# Altium schematic sheet Industrial-Controller_MCU1.SchDoc: MCU
size 558 x 431 mm; Date: not used; ApprovedBy: not used; CheckedBy: not used; Author: not used; DrawnBy: not used; Organization: not used; Address4: not used; SheetNumber: 6; SheetTotal: 21; Time: not used; ImagePath: not used; Application_BuildNumber: not used
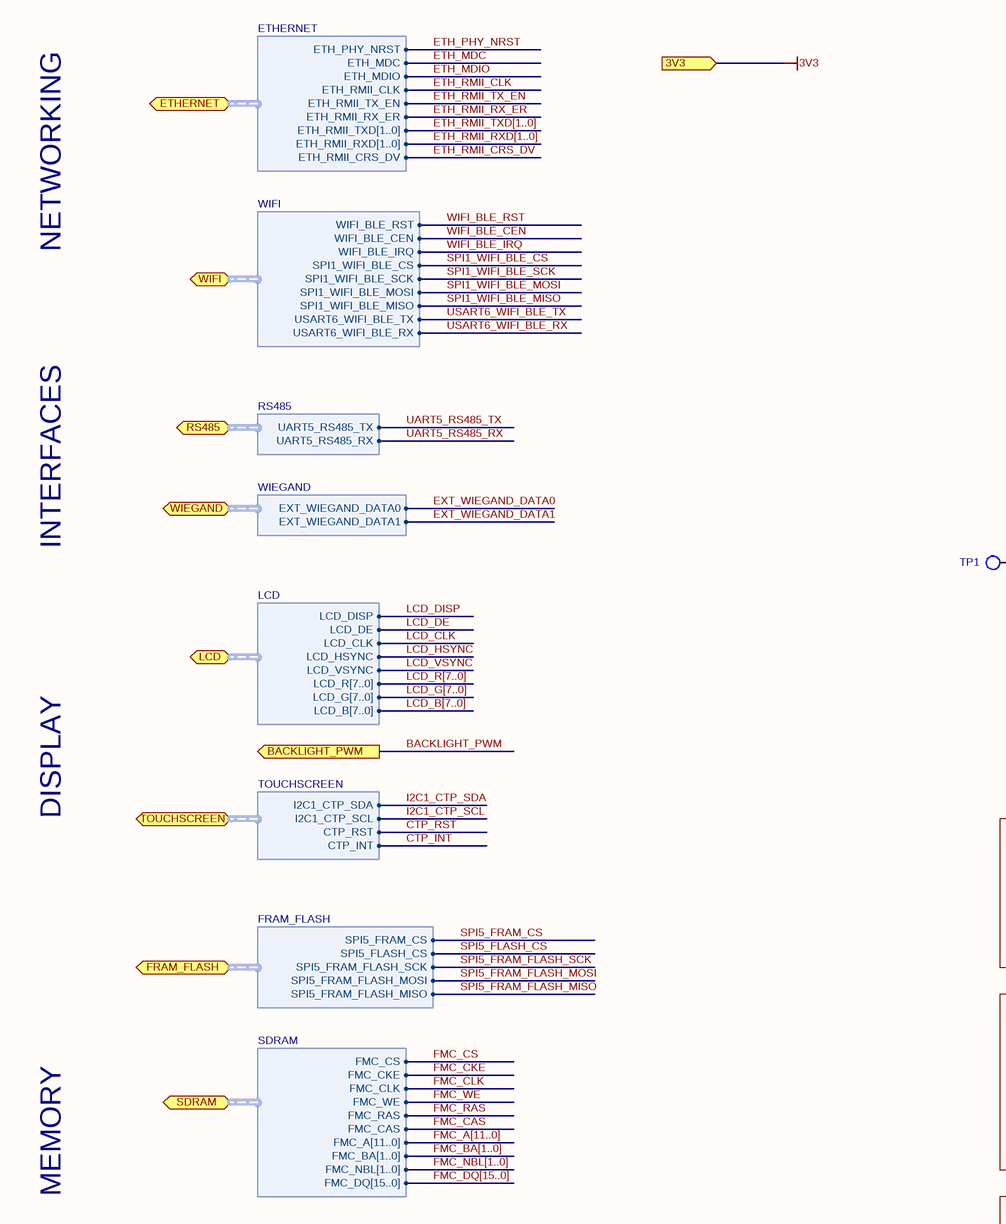
[diagram p0: Industrial-Controller_MCU1.SchDoc, top left]
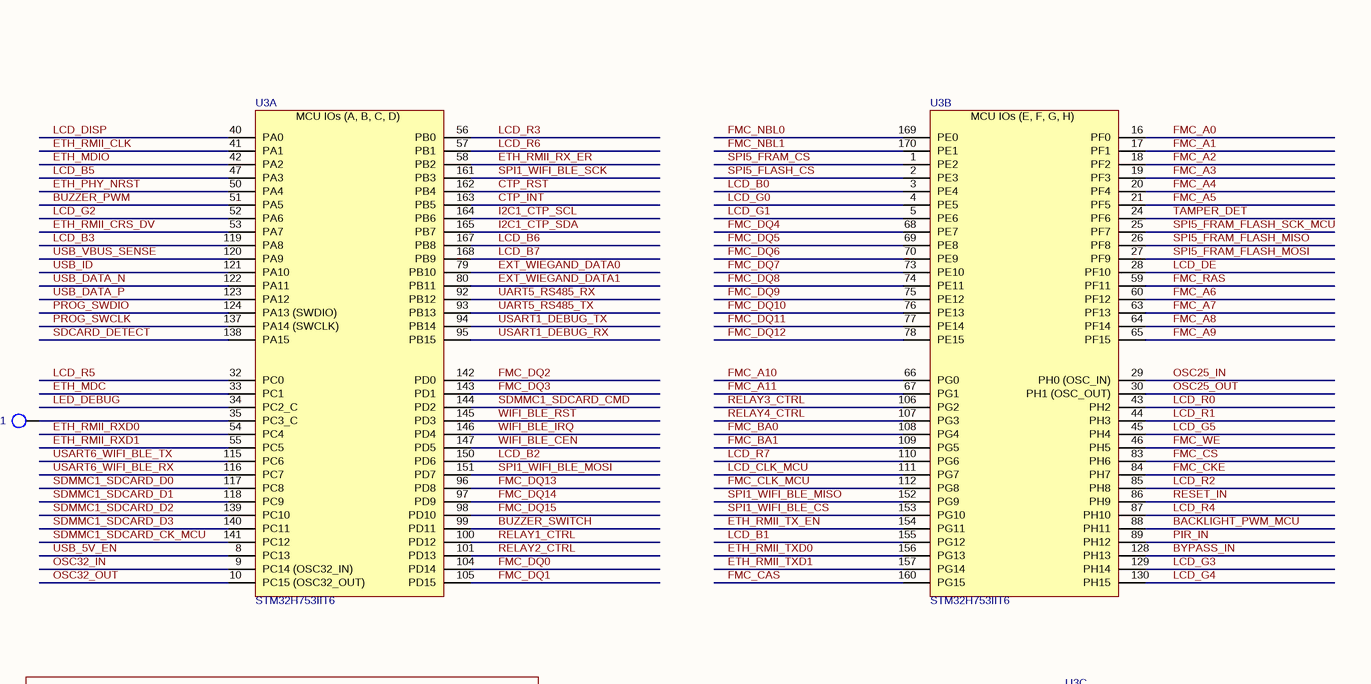
[diagram p1: Industrial-Controller_MCU1.SchDoc, top right]
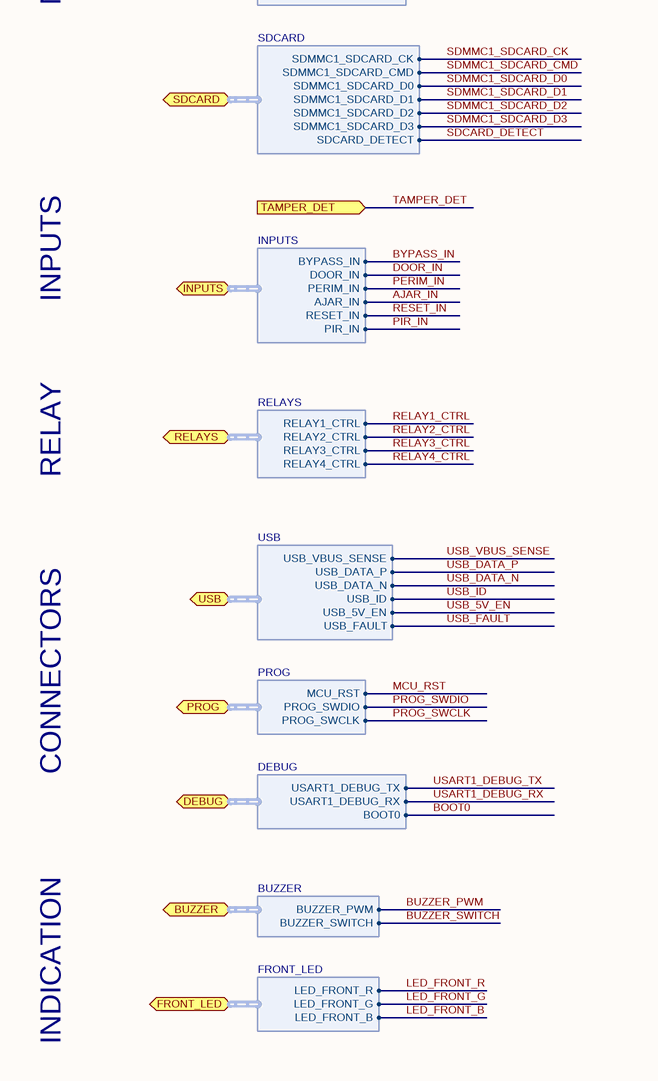
[diagram p2: Industrial-Controller_MCU1.SchDoc, bottom left]
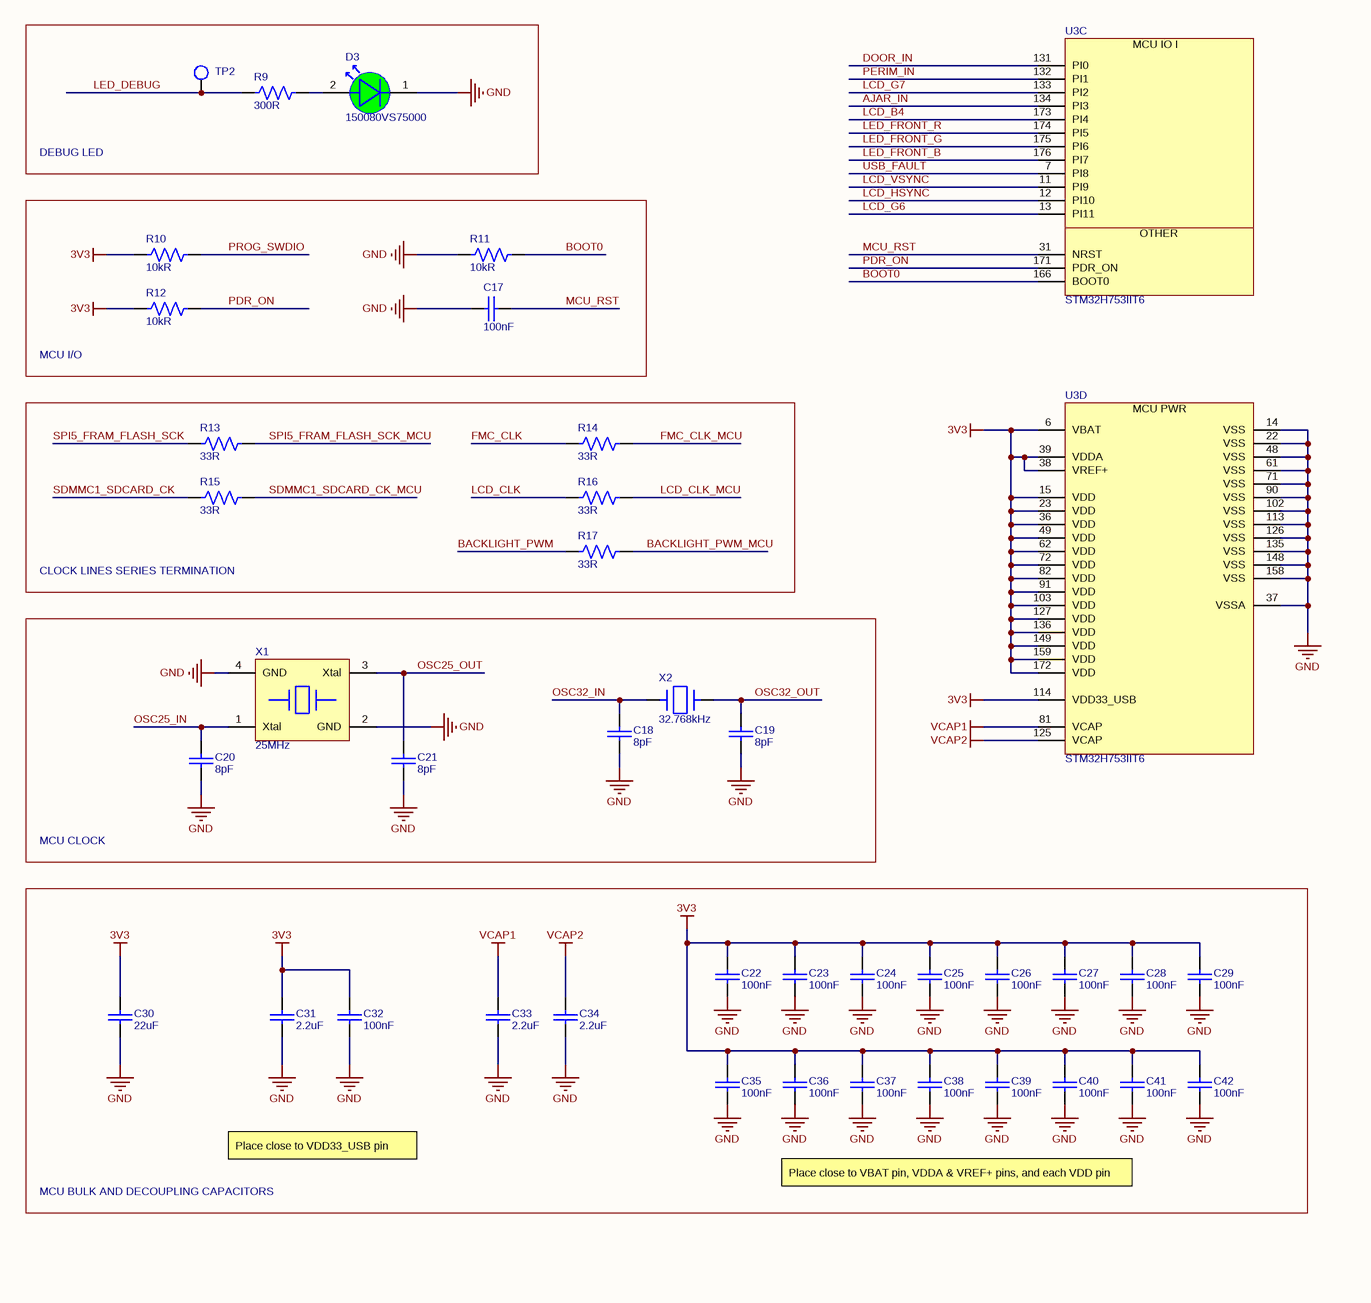
[diagram p3: Industrial-Controller_MCU1.SchDoc, bottom right]

## Parts
C17  100nF  [CAP_0603]
C18  8pF  [CAP_0603]
C19  8pF  [CAP_0603]
C20  8pF  [CAP_0603]
C21  8pF  [CAP_0603]
C22  100nF  [CAP_0603]
C23  100nF  [CAP_0603]
C24  100nF  [CAP_0603]
C25  100nF  [CAP_0603]
C26  100nF  [CAP_0603]
C27  100nF  [CAP_0603]
C28  100nF  [CAP_0603]
C29  100nF  [CAP_0603]
C30  22uF  [CAP_1210]
C31  2.2uF  [CAP_0603]
C32  100nF  [CAP_0603]
C33  2.2uF  [CAP_0603]
C34  2.2uF  [CAP_0603]
C35  100nF  [CAP_0603]
C36  100nF  [CAP_0603]
C37  100nF  [CAP_0603]
C38  100nF  [CAP_0603]
C39  100nF  [CAP_0603]
C40  100nF  [CAP_0603]
C41  100nF  [CAP_0603]
C42  100nF  [CAP_0603]
D3  150080VS75000  [LED_0805]
R9  300R  [RES_0603]
R10  10kR  [RES_0603]
R11  10kR  [RES_0603]
R12  10kR  [RES_0603]
R13  33R  [RES_0603]
R14  33R  [RES_0603]
R15  33R  [RES_0603]
R16  33R  [RES_0603]
R17  33R  [RES_0603]
TP1  TEST_POINT_SMT  [TEST_POINT_SMT]  (value not drawn)  (no BOM)
TP2  TEST_POINT_SMT  [TEST_POINT_SMT]  (value not drawn)  (no BOM)
U3  STM32H753IIT6  [LQFP176]  (parts A,B,C,D of 4)
X1  25MHz  [NX2016SA-25MHZ-EXS00A-CS11365]
X2  32.768kHz  [NX2012SA-32.768KHZ-EXS00A-MU00626]

## Blocks framed on the sheet
DEBUG LED: D3 R9 TP2
MCU I/O: C17 R10-R12
CLOCK LINES SERIES TERMINATION: R13-R17
MCU CLOCK: C18-C21 X1 X2
MCU BULK AND DECOUPLING CAPACITORS: C22-C42

## Ports
3V3 (in), BACKLIGHT_PWM (out), BUZZER (bidir, harness BUZZER), DEBUG (bidir, harness DEBUG), ETHERNET (bidir, harness ETHERNET), FRAM_FLASH (bidir, harness FRAM_FLASH), FRONT_LED (bidir, harness FRONT_LED), INPUTS (bidir, harness INPUTS), LCD (bidir, harness LCD), PROG (bidir, harness PROG), RELAYS (bidir, harness RELAYS), RS485 (bidir, harness RS485), SDCARD (bidir, harness SDCARD), SDRAM (bidir, harness SDRAM), TAMPER_DET (in), TOUCHSCREEN (bidir, harness TOUCHSCREEN), USB (bidir, harness USB), WIEGAND (bidir, harness WIEGAND), WIFI (bidir, harness WIFI)

## Harnesses
LCD: LCD_B[7..0], LCD_CLK, LCD_DE, LCD_DISP, LCD_G[7..0], LCD_HSYNC, LCD_R[7..0], LCD_VSYNC
ETHERNET: ETH_MDC, ETH_MDIO, ETH_PHY_NRST, ETH_RMII_CLK, ETH_RMII_CRS_DV, ETH_RMII_RXD[1..0], ETH_RMII_RX_ER, ETH_RMII_TXD[1..0], ETH_RMII_TX_EN
SDRAM: FMC_A[11..0], FMC_BA[1..0], FMC_CAS, FMC_CKE, FMC_CLK, FMC_CS, FMC_DQ[15..0], FMC_NBL[1..0], FMC_RAS, FMC_WE
INPUTS: AJAR_IN, BYPASS_IN, DOOR_IN, PERIM_IN, PIR_IN, RESET_IN
TOUCHSCREEN: CTP_INT, CTP_RST, I2C1_CTP_SCL, I2C1_CTP_SDA
BUZZER: BUZZER_SWITCH, BUZZER_PWM
RELAYS: RELAY1_CTRL, RELAY2_CTRL, RELAY3_CTRL, RELAY4_CTRL
FRONT_LED: LED_FRONT_B, LED_FRONT_G, LED_FRONT_R
WIEGAND: EXT_WIEGAND_DATA0, EXT_WIEGAND_DATA1
FRAM_FLASH: SPI5_FLASH_CS, SPI5_FRAM_CS, SPI5_FRAM_FLASH_MISO, SPI5_FRAM_FLASH_MOSI, SPI5_FRAM_FLASH_SCK
SDCARD: SDMMC1_SDCARD_CK, SDMMC1_SDCARD_CMD, SDMMC1_SDCARD_D0, SDMMC1_SDCARD_D1, SDMMC1_SDCARD_D2, SDMMC1_SDCARD_D3, SDCARD_DETECT
USB: USB_VBUS_SENSE, USB_DATA_P, USB_DATA_N, USB_ID, USB_5V_EN, USB_FAULT
DEBUG: USART1_DEBUG_TX, USART1_DEBUG_RX, BOOT0
PROG: MCU_RST, PROG_SWDIO, PROG_SWCLK
RS485: UART5_RS485_TX, UART5_RS485_RX
WIFI: WIFI_BLE_RST, WIFI_BLE_CEN, WIFI_BLE_IRQ, SPI1_WIFI_BLE_CS, SPI1_WIFI_BLE_SCK, SPI1_WIFI_BLE_MOSI, SPI1_WIFI_BLE_MISO, USART6_WIFI_BLE_TX, USART6_WIFI_BLE_RX

## Nets
3V3: C22.2 C23.2 C24.2 C25.2 C26.2 C27.2 C28.2 C29.2 C30.2 C31.2 C32.2 C35.2 C36.2 C37.2 C38.2 C39.2 C40.2 C41.2 C42.2 R10.1 R12.1 U3.6(VBAT) U3.15(VDD) U3.23(VDD) U3.36(VDD) U3.38(VREF+) U3.39(VDDA) U3.49(VDD) U3.62(VDD) U3.72(VDD) U3.82(VDD) U3.91(VDD) U3.103(VDD) U3.114(VDD33_USB) U3.127(VDD) U3.136(VDD) U3.149(VDD) U3.159(VDD) U3.172(VDD) ; port 3V3
GND: C17.1 C18.1 C19.1 C20.1 C21.1 C22.1 C23.1 C24.1 C25.1 C26.1 C27.1 C28.1 C29.1 C30.1 C31.1 C32.1 C33.1 C34.1 C35.1 C36.1 C37.1 C38.1 C39.1 C40.1 C41.1 C42.1 D3.1(C) R11.1 U3.14(VSS) U3.22(VSS) U3.37(VSSA) U3.48(VSS) U3.61(VSS) U3.71(VSS) U3.90(VSS) U3.102(VSS) U3.113(VSS) U3.126(VSS) U3.135(VSS) U3.148(VSS) U3.158(VSS) X1.2(GND) X1.4(GND)
VCAP1: C33.2 U3.81(VCAP)
VCAP2: C34.2 U3.125(VCAP)
AJAR_IN: U3.134(PI3) ; port INPUTS.AJAR_IN
BACKLIGHT_PWM: R17.1 ; port BACKLIGHT_PWM
BACKLIGHT_PWM_MCU: R17.2 U3.88(PH11)
BOOT0: R11.2 U3.166(BOOT0) ; port DEBUG.BOOT0
BUZZER_PWM: U3.51(PA5) ; port BUZZER.BUZZER_PWM
BUZZER_SWITCH: U3.99(PD11) ; port BUZZER.BUZZER_SWITCH
BYPASS_IN: U3.128(PH13) ; port INPUTS.BYPASS_IN
CTP_INT: U3.163(PB5) ; port TOUCHSCREEN.CTP_INT
CTP_RST: U3.162(PB4) ; port TOUCHSCREEN.CTP_RST
DOOR_IN: U3.131(PI0) ; port INPUTS.DOOR_IN
ETH_MDC: U3.33(PC1) ; port ETHERNET.ETH_MDC
ETH_MDIO: U3.42(PA2) ; port ETHERNET.ETH_MDIO
ETH_PHY_NRST: U3.50(PA4) ; port ETHERNET.ETH_PHY_NRST
ETH_RMII_CLK: U3.41(PA1) ; port ETHERNET.ETH_RMII_CLK
ETH_RMII_CRS_DV: U3.53(PA7) ; port ETHERNET.ETH_RMII_CRS_DV
ETH_RMII_RX_ER: U3.58(PB2) ; port ETHERNET.ETH_RMII_RX_ER
ETH_RMII_RXD0: U3.54(PC4)
ETH_RMII_RXD1: U3.55(PC5)
ETH_RMII_TX_EN: U3.154(PG11) ; port ETHERNET.ETH_RMII_TX_EN
ETH_RMII_TXD0: U3.156(PG13)
ETH_RMII_TXD1: U3.157(PG14)
EXT_WIEGAND_DATA0: U3.79(PB10) ; port WIEGAND.EXT_WIEGAND_DATA0
EXT_WIEGAND_DATA1: U3.80(PB11) ; port WIEGAND.EXT_WIEGAND_DATA1
FMC_A0: U3.16(PF0)
FMC_A1: U3.17(PF1)
FMC_A2: U3.18(PF2)
FMC_A3: U3.19(PF3)
FMC_A4: U3.20(PF4)
FMC_A5: U3.21(PF5)
FMC_A6: U3.60(PF12)
FMC_A7: U3.63(PF13)
FMC_A8: U3.64(PF14)
FMC_A9: U3.65(PF15)
FMC_A10: U3.66(PG0)
FMC_A11: U3.67(PG1)
FMC_BA0: U3.108(PG4)
FMC_BA1: U3.109(PG5)
FMC_CAS: U3.160(PG15) ; port SDRAM.FMC_CAS
FMC_CKE: U3.84(PH7) ; port SDRAM.FMC_CKE
FMC_CLK: R14.1 ; port SDRAM.FMC_CLK
FMC_CLK_MCU: R14.2 U3.112(PG8)
FMC_CS: U3.83(PH6) ; port SDRAM.FMC_CS
FMC_DQ0: U3.104(PD14)
FMC_DQ1: U3.105(PD15)
FMC_DQ2: U3.142(PD0)
FMC_DQ3: U3.143(PD1)
FMC_DQ4: U3.68(PE7)
FMC_DQ5: U3.69(PE8)
FMC_DQ6: U3.70(PE9)
FMC_DQ7: U3.73(PE10)
FMC_DQ8: U3.74(PE11)
FMC_DQ9: U3.75(PE12)
FMC_DQ10: U3.76(PE13)
FMC_DQ11: U3.77(PE14)
FMC_DQ12: U3.78(PE15)
FMC_DQ13: U3.96(PD8)
FMC_DQ14: U3.97(PD9)
FMC_DQ15: U3.98(PD10)
FMC_NBL0: U3.169(PE0)
FMC_NBL1: U3.170(PE1)
FMC_RAS: U3.59(PF11) ; port SDRAM.FMC_RAS
FMC_WE: U3.46(PH5) ; port SDRAM.FMC_WE
I2C1_CTP_SCL: U3.164(PB6) ; port TOUCHSCREEN.I2C1_CTP_SCL
I2C1_CTP_SDA: U3.165(PB7) ; port TOUCHSCREEN.I2C1_CTP_SDA
LCD_B0: U3.3(PE4)
LCD_B1: U3.155(PG12)
LCD_B2: U3.150(PD6)
LCD_B3: U3.119(PA8)
LCD_B4: U3.173(PI4)
LCD_B5: U3.47(PA3)
LCD_B6: U3.167(PB8)
LCD_B7: U3.168(PB9)
LCD_CLK: R16.1 ; port LCD.LCD_CLK
LCD_CLK_MCU: R16.2 U3.111(PG7)
LCD_DE: U3.28(PF10) ; port LCD.LCD_DE
LCD_DISP: U3.40(PA0) ; port LCD.LCD_DISP
LCD_G0: U3.4(PE5)
LCD_G1: U3.5(PE6)
LCD_G2: U3.52(PA6)
LCD_G3: U3.129(PH14)
LCD_G4: U3.130(PH15)
LCD_G5: U3.45(PH4)
LCD_G6: U3.13(PI11)
LCD_G7: U3.133(PI2)
LCD_HSYNC: U3.12(PI10) ; port LCD.LCD_HSYNC
LCD_R0: U3.43(PH2)
LCD_R1: U3.44(PH3)
LCD_R2: U3.85(PH8)
LCD_R3: U3.56(PB0)
LCD_R4: U3.87(PH10)
LCD_R5: U3.32(PC0)
LCD_R6: U3.57(PB1)
LCD_R7: U3.110(PG6)
LCD_VSYNC: U3.11(PI9) ; port LCD.LCD_VSYNC
LED_DEBUG: R9.1 TP2.1 U3.34(PC2_C)
LED_FRONT_B: U3.176(PI7) ; port FRONT_LED.LED_FRONT_B
LED_FRONT_G: U3.175(PI6) ; port FRONT_LED.LED_FRONT_G
LED_FRONT_R: U3.174(PI5) ; port FRONT_LED.LED_FRONT_R
MCU_RST: C17.2 U3.31(NRST) ; port PROG.MCU_RST
OSC25_IN: C20.2 U3.29(PH0_(OSC_IN)) X1.1(Xtal)
OSC25_OUT: C21.2 U3.30(PH1_(OSC_OUT)) X1.3(Xtal)
OSC32_IN: C18.2 U3.9(PC14_(OSC32_IN)) X2.1
OSC32_OUT: C19.2 U3.10(PC15_(OSC32_OUT)) X2.2
PDR_ON: R12.2 U3.171(PDR_ON)
PERIM_IN: U3.132(PI1) ; port INPUTS.PERIM_IN
PIR_IN: U3.89(PH12) ; port INPUTS.PIR_IN
PROG_SWCLK: U3.137(PA14_(SWCLK)) ; port PROG.PROG_SWCLK
PROG_SWDIO: R10.2 U3.124(PA13_(SWDIO)) ; port PROG.PROG_SWDIO
RELAY1_CTRL: U3.100(PD12) ; port RELAYS.RELAY1_CTRL
RELAY2_CTRL: U3.101(PD13) ; port RELAYS.RELAY2_CTRL
RELAY3_CTRL: U3.106(PG2) ; port RELAYS.RELAY3_CTRL
RELAY4_CTRL: U3.107(PG3) ; port RELAYS.RELAY4_CTRL
RESET_IN: U3.86(PH9) ; port INPUTS.RESET_IN
SDCARD_DETECT: U3.138(PA15) ; port SDCARD.SDCARD_DETECT
SDMMC1_SDCARD_CK: R15.1 ; port SDCARD.SDMMC1_SDCARD_CK
SDMMC1_SDCARD_CK_MCU: R15.2 U3.141(PC12)
SDMMC1_SDCARD_CMD: U3.144(PD2) ; port SDCARD.SDMMC1_SDCARD_CMD
SDMMC1_SDCARD_D0: U3.117(PC8) ; port SDCARD.SDMMC1_SDCARD_D0
SDMMC1_SDCARD_D1: U3.118(PC9) ; port SDCARD.SDMMC1_SDCARD_D1
SDMMC1_SDCARD_D2: U3.139(PC10) ; port SDCARD.SDMMC1_SDCARD_D2
SDMMC1_SDCARD_D3: U3.140(PC11) ; port SDCARD.SDMMC1_SDCARD_D3
SPI1_WIFI_BLE_CS: U3.153(PG10) ; port WIFI.SPI1_WIFI_BLE_CS
SPI1_WIFI_BLE_MISO: U3.152(PG9) ; port WIFI.SPI1_WIFI_BLE_MISO
SPI1_WIFI_BLE_MOSI: U3.151(PD7) ; port WIFI.SPI1_WIFI_BLE_MOSI
SPI1_WIFI_BLE_SCK: U3.161(PB3) ; port WIFI.SPI1_WIFI_BLE_SCK
SPI5_FLASH_CS: U3.2(PE3) ; port FRAM_FLASH.SPI5_FLASH_CS
SPI5_FRAM_CS: U3.1(PE2) ; port FRAM_FLASH.SPI5_FRAM_CS
SPI5_FRAM_FLASH_MISO: U3.26(PF8) ; port FRAM_FLASH.SPI5_FRAM_FLASH_MISO
SPI5_FRAM_FLASH_MOSI: U3.27(PF9) ; port FRAM_FLASH.SPI5_FRAM_FLASH_MOSI
SPI5_FRAM_FLASH_SCK: R13.1 ; port FRAM_FLASH.SPI5_FRAM_FLASH_SCK
SPI5_FRAM_FLASH_SCK_MCU: R13.2 U3.25(PF7)
TAMPER_DET: U3.24(PF6) ; port TAMPER_DET
UART5_RS485_RX: U3.92(PB12) ; port RS485.UART5_RS485_RX
UART5_RS485_TX: U3.93(PB13) ; port RS485.UART5_RS485_TX
USART1_DEBUG_RX: U3.95(PB15) ; port DEBUG.USART1_DEBUG_RX
USART1_DEBUG_TX: U3.94(PB14) ; port DEBUG.USART1_DEBUG_TX
USART6_WIFI_BLE_RX: U3.116(PC7) ; port WIFI.USART6_WIFI_BLE_RX
USART6_WIFI_BLE_TX: U3.115(PC6) ; port WIFI.USART6_WIFI_BLE_TX
USB_5V_EN: U3.8(PC13) ; port USB.USB_5V_EN
USB_DATA_N: U3.122(PA11) ; port USB.USB_DATA_N
USB_DATA_P: U3.123(PA12) ; port USB.USB_DATA_P
USB_FAULT: U3.7(PI8) ; port USB.USB_FAULT
USB_ID: U3.121(PA10) ; port USB.USB_ID
USB_VBUS_SENSE: U3.120(PA9) ; port USB.USB_VBUS_SENSE
WIFI_BLE_CEN: U3.147(PD5) ; port WIFI.WIFI_BLE_CEN
WIFI_BLE_IRQ: U3.146(PD4) ; port WIFI.WIFI_BLE_IRQ
WIFI_BLE_RST: U3.145(PD3) ; port WIFI.WIFI_BLE_RST
NetD3_2: D3.2(A) R9.2
NetTP1_1: TP1.1 U3.35(PC3_C)

## Buses and harness runs
bus ETH_RMII_RXD[1..0]
bus ETH_RMII_TXD[1..0]
bus FMC_A[11..0]
bus FMC_BA[1..0]
bus FMC_DQ[15..0]
bus FMC_NBL[1..0]
bus LCD_B[7..0]
bus LCD_G[7..0]
bus LCD_R[7..0]

## Notes on the sheet
- NETWORKING
- INTERFACES
- DISPLAY
- MEMORY
- INPUTS
- RELAY
- CONNECTORS
- Place close to VDD33_USB pin
- Place close to VBAT pin, VDDA & VREF+ pins, and each VDD pin
- INDICATION
- Title:
- Date:
- Size C
- Project:
- Number:
- Time:
- Sheet
- Revision
- of
- Engineer:
- www.rft.com <http://www.rft.com>
- File:
- (in symbol STM32H753IIT6, part A) MCU IOs (A, B, C, D)
- (in symbol STM32H753IIT6, part B) MCU IOs (E, F, G, H)
- (in symbol STM32H753IIT6, part C) MCU IO I; OTHER
- (in symbol STM32H753IIT6, part D) MCU PWR

## Library data of the parts
C17 C22-C29 C32 C35-C42 = CL10B104KB8NNNL: CAP CER 0.1UF 50V X7R 0603; Manufacturer 1: Samsung; Tolerance: 10%; Supplier 1: Digi-Key; Manufacturer Part Number 1: CL10B104KB8NNNL; RoHS: Yes; Category: Ceramic Capacitors; Stock 1: 2348404; Pricing 1: 15000=0,00532, 30000=0,00506 (USD); Mount: Surface Mount; Case/Package: 0603; Min Operating Temperature: -55°C; Max Operating Temperature: 125°C; Capacitance: 100nF; Packaging: Tape and Reel; Package Quantity: 15000; Voltage Rating: 50V; Dielectric: X7R; Voltage Rating (DC): 50V; Series: CL; Construction: Flat; Length: 1.6mm; Width: 0.031inch; Height: 0.8mm; Thickness: 0.035inch; Depth: 0.8mm; Radiation Hardening: No; RoHS Compliant: Yes; ComponentLink1URL: https://datasheet.ciiva.com/26838/getdatasheetpartid-357523-26838415.pdf?src-supplier=Verical; ComponentLink1Description: https://datasheet.ciiva.com/26838/getdatasheetpartid-357523-26838415.pdf?src-supplier=Verical; ComponentLink2URL: https://datasheet.ciiva.com/25741/cl10b104kb8nnnl-25741341.pdf?src-supplier=Digi-Key; ComponentLink2Description: https://datasheet.ciiva.com/25741/cl10b104kb8nnnl-25741341.pdf?src-supplier=Digi-Key; Supplier Part Number 1: 1276-CL10B104KB8NNNLTR-ND
C18-C21 = CC0603DRNPO9BN8R0: CAP CER 8PF 50V C0G/NPO 0603; Manufacturer 1: Yageo; Dielectric: C0G; Supplier 1: Digi-Key; Manufacturer Part Number 1: CC0603DRNPO9BN8R0; RoHS: Yes; Category: Ceramic Capacitors; Stock 1: 105535; Pricing 1: 1=0,10000, 10=0,06200, 50=0,03360, 100=0,02740, 500=0,01960, 1000=0,01540 (USD); Case/Package: 0603; Case Code (Metric): 1608; Case Code (Imperial): 0603; Min Operating Temperature: -55°C; Max Operating Temperature: 125°C; Capacitance: 8pF; Packaging: Tape and Reel; Voltage Rating (DC): 50V; Voltage Rating: 50V; RoHS Compliant: Yes; ComponentLink1URL: https://datasheet.ciiva.com/145/mlccorderingcode-145149.pdf?src-supplier=Digi-Key; ComponentLink1Description: https://datasheet.ciiva.com/145/mlccorderingcode-145149.pdf?src-supplier=Digi-Key; ComponentLink2URL: https://datasheet.ciiva.com/145/mlccorderingcode-145150.pdf?src-supplier=Digi-Key; ComponentLink2Description: https://datasheet.ciiva.com/145/mlccorderingcode-145150.pdf?src-supplier=Digi-Key; Supplier Part Number 1: 311-1057-1-ND; Mount: Surface Mount; Package Quantity: 4000; Termination: SMD/SMT; Resistor Type: Ceramic; Series: CC; Construction: Flat; Length: 1.6mm; Width: 0.031inch; Height: 0.8mm; Thickness: 0.035inch; Depth: 0.8mm; Lead Free: Lead Free; ComponentLink3URL: https://datasheet.ciiva.com/13386/upy-gp-np0-16v-to-50v-8-13386318.pdf?src-supplier=Mouser; ComponentLink3Description: https://datasheet.ciiva.com/13386/upy-gp-np0-16v-to-50v-8-13386318.pdf?src-supplier=Mouser; ComponentLink4URL: https://datasheet.ciiva.com/145/mlccorderingcode-145151.pdf?src-supplier=Digi-Key; ComponentLink4Description: https://datasheet.ciiva.com/145/mlccorderingcode-145151.pdf?src-supplier=Digi-Key
C30 = CL32B226KAJNNNE: CAP CER 22UF 25V X7R 1210; Manufacturer 1: Samsung; Material: Ceramic; Tolerance: 10%; Supplier 1: Digi-Key; Manufacturer Part Number 1: CL32B226KAJNNNE; RoHS: Yes; Category: Ceramic Capacitors; Stock 1: 784003; Pricing 1: 1=0,58000, 10=0,41000, 50=0,31000, 100=0,26990, 500=0,19996 (USD); Mount: Surface Mount; Case/Package: 1210; Case Code (Metric): 3225; Case Code (Imperial): 1210; Min Operating Temperature: -55°C; Max Operating Temperature: 125°C; Package Quantity: 1; Packaging: Tape and Reel; Capacitance: 22uF; Voltage Rating: 25V; Dielectric: X7R; Series: CL; Construction: Flat; Voltage Rating (DC): 25V; Length: 3.2mm; Width: 0.098inch; Height: 2.5mm; Thickness: 0.106inch; Depth: 2.5mm; Radiation Hardening: No; RoHS Compliant: Yes; Lead Free: Lead Free; ComponentLink1URL: https://datasheet.ciiva.com/25714/cl32b226kajnnne-25714610.pdf?src-supplier=Digi-Key; ComponentLink1Description: https://datasheet.ciiva.com/25714/cl32b226kajnnne-25714610.pdf?src-supplier=Digi-Key; Supplier Part Number 1: 1276-3392-1-ND
C31 C33 C34 = CL10B225KP8NNNC: CAP CER 2.2UF 10V X7R 0603; Manufacturer 1: Samsung; Material: Ceramic; Tolerance: 10%; Supplier 1: Digi-Key; Manufacturer Part Number 1: CL10B225KP8NNNC; RoHS: Yes; Category: Ceramic Capacitors; Stock 1: 208016; Pricing 1: 1=0,11000, 10=0,08000, 50=0,04560, 100=0,03770, 500=0,02644, 1000=0,02189 (USD); Mount: Surface Mount; Case/Package: 0603; Case Code (Metric): 1608; Case Code (Imperial): 0603; Contact Plating: Tin; Min Operating Temperature: -55°C; Max Operating Temperature: 125°C; Package Quantity: 1; Packaging: Tape and Reel; Capacitance: 2.2uF; Voltage Rating: 10V; Dielectric: X7R; Series: CL; Construction: Flat; Length: 1.6mm; Width: 0.031inch; Height: 0.8mm; Thickness: 0.035inch; Depth: 0.8mm; Radiation Hardening: No; RoHS Compliant: Yes; ComponentLink1URL: https://datasheet.ciiva.com/15227/getdatasheetpartid-359568-15227195.pdf?src-supplier=Verical; ComponentLink1Description: https://datasheet.ciiva.com/15227/getdatasheetpartid-359568-15227195.pdf?src-supplier=Verical; ComponentLink2URL: https://datasheet.ciiva.com/25798/cl10b225kp8nnnc-25798914.pdf?src-supplier=Digi-Key; ComponentLink2Description: https://datasheet.ciiva.com/25798/cl10b225kp8nnnc-25798914.pdf?src-supplier=Digi-Key; ComponentLink3URL: https://datasheet.ciiva.com/16500/cl10b225kp8nnnc-16500695.pdf?src-supplier=Future+Electronics; ComponentLink3Description: https://datasheet.ciiva.com/16500/cl10b225kp8nnnc-16500695.pdf?src-supplier=Future+Electronics; ComponentLink4URL: https://datasheet.ciiva.com/29198/457933-da-01-en-vs-kondensator-0603-29198589.pdf?src-supplier=Conrad; ComponentLink4Description: https://datasheet.ciiva.com/29198/457933-da-01-en-vs-kondensator-0603-29198589.pdf?src-supplier=Conrad; Supplier Part Number 1: 1276-1134-1-ND
D3 = 150080VS75000: LED GREEN CLEAR 0805 SMD; Manufacturer 1: Wurth Electronics; Luminous Intensity: 40mcd; Forward Current: 30mA; Forward Voltage: 2V; Viewing Angle: 140°; Wavelength: 570nm; Lens Style: Clear,Rectangular; Test Current: 20mA; Supplier 1: Digi-Key; Manufacturer Part Number 1: 150080VS75000; RoHS: Yes; Category: LEDs; Stock 1: 24066; Pricing 1: 1=0,18000, 50=0,17100, 100=0,14700, 500=0,12700 (USD); Mount: Surface Mount; Case/Package: 0805; Color: Green; Case Code (Metric): 2012; Case Code (Imperial): 0805; Min Operating Temperature: -40°C; Max Operating Temperature: 85°C; Package Quantity: 4000; Packaging: Tape and Reel; Dominant Wavelength: 570nm; Length: 2mm; Width: 1.25mm; Height: 0.7mm; REACH SVHC: Unknown; ComponentLink1URL: https://datasheet.ciiva.com/22656/150080vs75000-22656966.pdf?src-supplier=Element14; ComponentLink1Description: https://datasheet.ciiva.com/22656/150080vs75000-22656966.pdf?src-supplier=Element14; ComponentLink2URL: https://datasheet.ciiva.com/29279/759437-da-01-en-chipled-0805-w-kl-h-gruen-150080vs7500-29279047.pdf?src-supplier=Conrad; ComponentLink2Description: https://datasheet.ciiva.com/29279/759437-da-01-en-chipled-0805-w-kl-h-gruen-150080vs7500-29279047.pdf?src-supplier=Conrad; ComponentLink3URL: https://datasheet.ciiva.com/29563/150080vs75000-29563018.pdf?src-supplier=Digi-Key; ComponentLink3Description: https://datasheet.ciiva.com/29563/150080vs75000-29563018.pdf?src-supplier=Digi-Key; Supplier Part Number 1: 732-4986-1-ND
R9 = RC0603JR-07300RL: RES 300 OHM 5% 1/10W 0603; Manufacturer 1: Yageo; Power Rating: 100mW; Voltage Rating: 75V; Temperature Coefficient: 100ppm/°C; Voltage Rating (DC): 50V; Supplier 1: Digi-Key; Manufacturer Part Number 1: RC0603JR-07300RL; RoHS: Yes; Category: Chip SMD Resistors; Stock 1: 901383; Pricing 1: 1=0,10000, 10=0,02000, 100=0,00800, 1000=0,00360, 2500=0,00312 (USD); Case/Package: 0603; Number of Pins: 2; Case Code (Imperial): 0603; Case Code (Metric): 1608; Weight: 7.1E-05oz; Size Code: 0603; Min Operating Temperature: -55°C; Max Operating Temperature: 155°C; Tolerance: 5%; Resistance: 300R; Packaging: Tape and Reel; Termination: SMD/SMT; Resistor Type: Thick Film; Features: Moisture Resistant; Series: RC; Max Power Dissipation: 100mW; Number of Terminations: 2; Resistance Tolerance: 5%; Construction: Rectangular; Length: 1.6mm; Width: 0.8mm; Height: 0.45mm; Depth: 0.8mm; REACH SVHC: Unknown; Military Standard: Not; Lead Free: Lead Free; RoHS Compliant: Yes; ComponentLink1URL: http://www.farnell.com/datasheets/2167052.pdf?src-supplier=Farnell; ComponentLink1Description: http://www.farnell.com/datasheets/2167052.pdf?src-supplier=Farnell; ComponentLink2URL: http://www.mouser.com/ds/2/447/RC0603-1212058.pdf?src-supplier=Mouser; ComponentLink2Description: http://www.mouser.com/ds/2/447/RC0603-1212058.pdf?src-supplier=Mouser; ComponentLink3URL: http://components.arrow.com/part/dataview/0323_03543424?src-supplier=Arrow+Europe; ComponentLink3Description: http://components.arrow.com/part/dataview/0323_03543424?src-supplier=Arrow+Europe; ComponentLink4URL: http://www.yageo.com/documents/recent/PYu-RC_Group_51_RoHS_L_9.pdf?src-supplier=Digi-Key; ComponentLink4Description: http://www.yageo.com/documents/recent/PYu-RC_Group_51_RoHS_L_9.pdf?src-supplier=Digi-Key; ComponentLink5URL: http://www.yageo.com/documents/recent/PYu-RC_Group_51_RoHS_L_10.pdf?src-supplier=Digi-Key; ComponentLink5Description: http://www.yageo.com/documents/recent/PYu-RC_Group_51_RoHS_L_10.pdf?src-supplier=Digi-Key; ComponentLink6URL: http://www.farnell.com/datasheets/2167052.pdf?src-supplier=Element14; ComponentLink6Description: http://www.farnell.com/datasheets/2167052.pdf?src-supplier=Element14; ComponentLink7URL: http://www.farnell.com/datasheets/1868787.pdf?src-supplier=Newark; ComponentLink7Description: http://www.farnell.com/datasheets/1868787.pdf?src-supplier=Newark; ComponentLink8URL: http://www.yageo.com/documents/recent/PYu-RC0603_51_RoHS_L_7.pdf?src-supplier=Future+Electronics; ComponentLink8Description: http://www.yageo.com/documents/recent/PYu-RC0603_51_RoHS_L_7.pdf?src-supplier=Future+Electronics; Supplier Part Number 1: 311-300GRCT-ND
R10-R12 = RC0603JR-0710KP: RES SMD 10K OHM 5% 1/10W 0603; Manufacturer 1: Yageo; Max Power Dissipation: 100mW; Temperature Coefficient: 150ppm/°C; Supplier 1: Digi-Key; Manufacturer Part Number 1: RC0603JR-0710KP; RoHS: Yes; Category: Chip SMD Resistors; Stock 1: 60966; Pricing 1: 1=0,10000, 10=0,04000, 100=0,01610, 1000=0,00725, 2500=0,00630 (USD); Case/Package: 0603; Case Code (Metric): 1608; Case Code (Imperial): 0603; Min Operating Temperature: -55°C; Max Operating Temperature: 155°C; Packaging: Tape and Reel; Resistance: 10kR; Resistor Type: Thick Film; Number of Terminations: 2; Tolerance: 5%; Features: Moisture Resistant; Length: 0.063inch; Width: 0.031inch; Height: 0.022inch; RoHS Compliant: Yes; ComponentLink1URL: http://www.yageo.com/NewPortal/yageodocoutput?fileName=/pdf/R-Chip/PYu-RC_51_RoHS_P_0.pdf&src-supplier=Digi-Key; ComponentLink1Description: http://www.yageo.com/NewPortal/yageodocoutput?fileName=/pdf/R-Chip/PYu-RC_51_RoHS_P_0.pdf&src-supplier=Digi-Key; Supplier Part Number 1: YAG1309CT-ND
R13-R17 = RC0603JR-0733RL: RES 33 OHM 5% 1/10W 0603; Manufacturer 1: Yageo; Power Rating: 100mW; Voltage Rating: 50V; Temperature Coefficient: 100ppm/°C; Supplier 1: Digi-Key; Manufacturer Part Number 1: RC0603JR-0733RL; RoHS: Yes; Category: Chip SMD Resistors; Stock 1: 254324; Pricing 1: 1=0,10000, 10=0,02000, 100=0,00800, 1000=0,00360, 2500=0,00312 (USD); Case/Package: 0603; Number of Pins: 2; Case Code (Metric): 1608; Case Code (Imperial): 0603; Size Code: 0603; Min Operating Temperature: -55°C; Max Operating Temperature: 155°C; Package Quantity: 1; Resistance: 33R; Tolerance: 5%; Packaging: Tape and Reel; Voltage Rating (DC): 50V; Resistor Type: Thick Film; Number of Terminations: 2; Termination: SMD/SMT; Max Power Dissipation: 100mW; Features: Moisture Resistant; Series: RC; Resistance Tolerance: 5%; Construction: Rectangular; Length: 0.063inch; Width: 0.031inch; Height: 0.022inch; Depth: 0.8mm; REACH SVHC: No SVHC; Military Standard: Not; Lead Free: Lead Free; RoHS Compliant: Yes; ComponentLink1URL: https://datasheet.ciiva.com/2452/pyu-r-int-thick-7-2452896.pdf?src-supplier=Digi-Key; ComponentLink1Description: https://datasheet.ciiva.com/2452/pyu-r-int-thick-7-2452896.pdf?src-supplier=Digi-Key; ComponentLink2URL: https://datasheet.ciiva.com/2452/pyu-r-int-thick-7-2452897.pdf?src-supplier=Digi-Key; ComponentLink2Description: https://datasheet.ciiva.com/2452/pyu-r-int-thick-7-2452897.pdf?src-supplier=Digi-Key; ComponentLink3URL: https://datasheet.ciiva.com/2452/pyu-r-int-thick-7-2452898.pdf?src-supplier=Digi-Key; ComponentLink3Description: https://datasheet.ciiva.com/2452/pyu-r-int-thick-7-2452898.pdf?src-supplier=Digi-Key; ComponentLink4URL: https://datasheet.ciiva.com/7746/1868787-7746491.pdf?src-supplier=Element14; ComponentLink4Description: https://datasheet.ciiva.com/7746/1868787-7746491.pdf?src-supplier=Element14; ComponentLink5URL: https://datasheet.ciiva.com/46395/443971-46395147.pdf?src-supplier=Element14; ComponentLink5Description: https://datasheet.ciiva.com/46395/443971-46395147.pdf?src-supplier=Element14; ComponentLink6URL: https://datasheet.ciiva.com/7746/443971-7746492.pdf?src-supplier=Element14; ComponentLink6Description: https://datasheet.ciiva.com/7746/443971-7746492.pdf?src-supplier=Element14; Supplier Part Number 1: 311-33GRCT-ND
TP1 TP2 = TEST_POINT_SMT: STM test point
U3 = STM32H753IIT6: IC MCU 32BIT 2MB FLASH 176LQFP; Manufacturer 1: STMicroelectronics; Supplier 1: Digi-Key; Manufacturer Part Number 1: STM32H753IIT6; RoHS: Yes; Category: Microcontrollers; Pricing 1: 1=20,80000, 10=19,12000, 25=18,32760, 80=16,51125 (USD); ComponentLink1URL: http://www.st.com/content/ccc/resource/technical/document/datasheet/group3/01/21/00/39/12/c9/4c/f1/DM00388325/files/DM00388325.pdf/jcr:content/translations/en.DM00388325.pdf?src-supplier=Digi-Key; ComponentLink1Description: http://www.st.com/content/ccc/resource/technical/document/datasheet/group3/01/21/00/39/12/c9/4c/f1/DM00388325/files/DM00388325.pdf/jcr:content/translations/en.DM00388325.pdf?src-supplier=Digi-Key; Supplier Part Number 1: 497-18565-ND
X1 = NX2016SA-25MHZ-EXS00A-CS11365: Crystal 25.0000MHZ 6PF SMD; Manufacturer 1: NDK; Supplier 1: Digi-Key; Manufacturer Part Number 1: NX2016SA-25MHZ-EXS00A-CS11365; RoHS: No; Stock 1: 4543; Pricing 1: 1=0,58000, 10=0,48200, 50=0,43420, 100=0,38600, 500=0,36670, 1000=0,30880 (USD); Supplier Part Number 1: 644-1317-1-ND; Frequency: 25MHz
X2 = NX2012SA-32.768KHZ-EXS00A-MU00626: Crystal 32.7680KHZ 6PF SMD; Manufacturer 1: NDK; ESR (Equivalent Series Resistance): 80kR; Supplier 1: Digi-Key; Manufacturer Part Number 1: NX2012SA-32.768KHZ-EXS00A-MU00626; RoHS: No; Stock 1: 5846; Pricing 1: 1=0,64000, 10=0,53100, 50=0,47760, 100=0,42460, 500=0,40336, 1000=0,33968 (USD); Mount: Surface Mount; Case/Package: SMD/SMT; Min Operating Temperature: -40°C; Max Operating Temperature: 85°C; Packaging: Cut Tape; Frequency: 32.768kHz; Load Capacitance: 6pF; Supplier Part Number 1: 644-1355-1-ND